# Altium schematic sheet debug.schdoc: DEBUG
size A4; Date: 10.01.2026; CheckedBy: BCY; DrawnBy: miaow; Revision: v1.0.0; SheetNumber: 14; SheetTotal: 18; BoardType: MAIN_PCB; Desc: UART & console
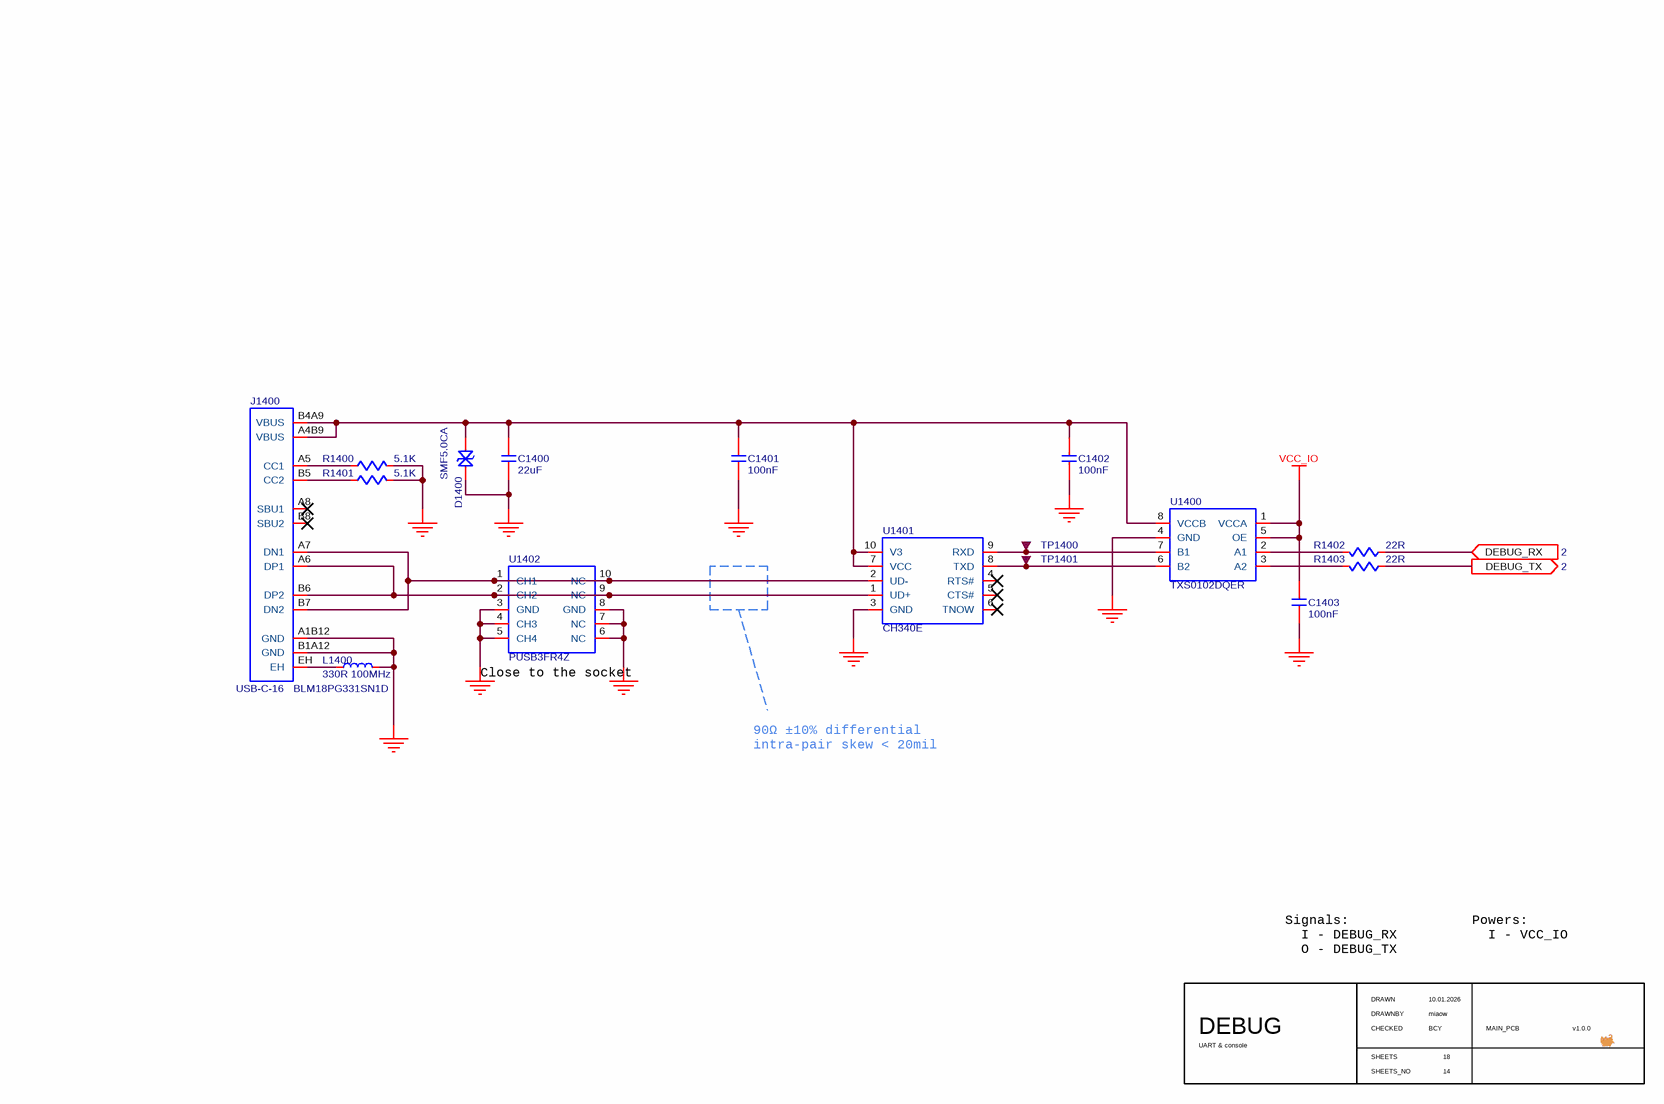
[diagram p0: debug.schdoc]

## Parts
C1400  value 22uF  [C0603]  (hidden comment: C-NOMO)
C1401  value 100nF  [C0402]  (hidden comment: C-NOMO)
C1402  value 100nF  [C0402]  (hidden comment: C-NOMO)
C1403  value 100nF  [C0402]  (hidden comment: C-NOMO)
D1400  SMF5.0CA  [SMF5.0CA]
J1400  USB-C-16  [USB-C-16]
L1400  BLM18PG331SN1D  value 330R 100MHz  [L0603]
R1400  value 5.1K  [R0402]  (hidden comment: R)
R1401  value 5.1K  [R0402]  (hidden comment: R)
R1402  value 22R  [R0402]  (hidden comment: R)
R1403  value 22R  [R0402]  (hidden comment: R)
TP1400  TP  [TP]  (value not drawn)
TP1401  TP  [TP]  (value not drawn)
U1400  TXS0102DQER  [TXS0102DQER]
U1401  CH340E  [CH340E]
U1402  PUSB3FR4Z  [PUSB3FR4Z]

## Ports
DEBUG_RX (in, see 2), DEBUG_TX (out, see 2)

## Nets
GND: C1400.1 C1401.1 C1402.1 C1403.1 D1400.1 J1400.A1B12(GND) J1400.B1A12(GND) L1400.2 R1400.1 R1401.1 U1400.4(GND) U1401.3(GND) U1402.3(GND) U1402.4(CH3) U1402.5(CH4) U1402.6(NC) U1402.7(NC) U1402.8(GND)
VCC_IO: C1403.2 U1400.1(VCCA) U1400.5(OE)
DEBUG_RX: R1402.2 ; port DEBUG_RX
DEBUG_TX: R1403.2 ; port DEBUG_TX
NetC1400_2: C1400.2 C1401.2 C1402.2 D1400.2 J1400.A4B9(VBUS) J1400.B4A9(VBUS) U1400.8(VCCB) U1401.7(VCC) U1401.10(V3)
NetJ1400_A5: J1400.A5(CC1) R1400.2
NetJ1400_A6: J1400.A6(DP1) J1400.B6(DP2) U1401.1(UD+) U1402.2(CH2) U1402.9(NC)
NetJ1400_A7: J1400.A7(DN1) J1400.B7(DN2) U1401.2(UD-) U1402.1(CH1) U1402.10(NC)
NetJ1400_B5: J1400.B5(CC2) R1401.2
NetJ1400_EH: J1400.EH L1400.1
NetR1402_1: R1402.1 U1400.2(A1)
NetR1403_1: R1403.1 U1400.3(A2)
NetTP1400_0: TP1400.0 U1400.7(B1) U1401.9(RXD)
NetTP1401_0: TP1401.0 U1400.6(B2) U1401.8(TXD)

Not connected (* = marked no-connect by the designer): J1400 A8(SBU1)* B8(SBU2)*; U1401 4(RTS#)* 5(CTS#)* 6(TNOW)*

## Notes on the sheet
- (near U1402) Close to the socket
- 90Ω ±10% differential
- intra-pair skew < 20mil
- Signals:
  I - DEBUG_RX
  O - DEBUG_TX
- Powers:
  I - VCC_IO
- DRAWN
- CHECKED
- DRAWNBY
- SHEETS
- SHEETS_NO

## Library data of the parts
C1400 = C-NOMO: voltage: 10V; precision: 20%; Supplier 1: LCSC; Supplier Part Number 1: C2980159
C1401-C1403 = C-NOMO: voltage: 50V; precision: 10%; Supplier 1: LCSC; Supplier Part Number 1: C307331
D1400 = SMF5.0CA: TVS/ESD; Supplier 1: LCSC; Supplier Part Number 1: C19077498
L1400 = L: Code_IEC: 1005; Published: 8-Jun-2000; LatestRevisionDate: 29-May-2009; LatestRevisionNote: IPC-7351 Footprint Added.; PackageReference: 0402-A; Publisher: Altium Limited; PackageDescription: Chip Inductor; Code_JEITA: 0402; Supplier 1: LCSC; Supplier Part Number 1: C79913
R1400-R1403 = R: precision: 1%; Supplier 1: LCSC
  R1400 R1401: Supplier Part Number 1: C25905
  R1402 R1403: Supplier Part Number 1: C25092
U1400 = TXS0102DQER: LEVEL SHIFT - 2bits, autodir, 1.65V - 3.6V, 2.3V - 5.5V, 24Mbps; Supplier Part Number 1: C2652935; Supplier 1: LCSC
U1401 = CH340E: USB UART; Supplier 1: LCSC; Supplier Part Number 1: C99652
U1402 = PUSB3FR4Z: TVS/ESD - USB, HDMI; Supplier 1: LCSC; Supplier Part Number 1: C503418
J1400 = USB-C-16: Supplier 1: LCSC; Supplier Part Number 1: C165948